# Altium project bee_hive.PrjPcb
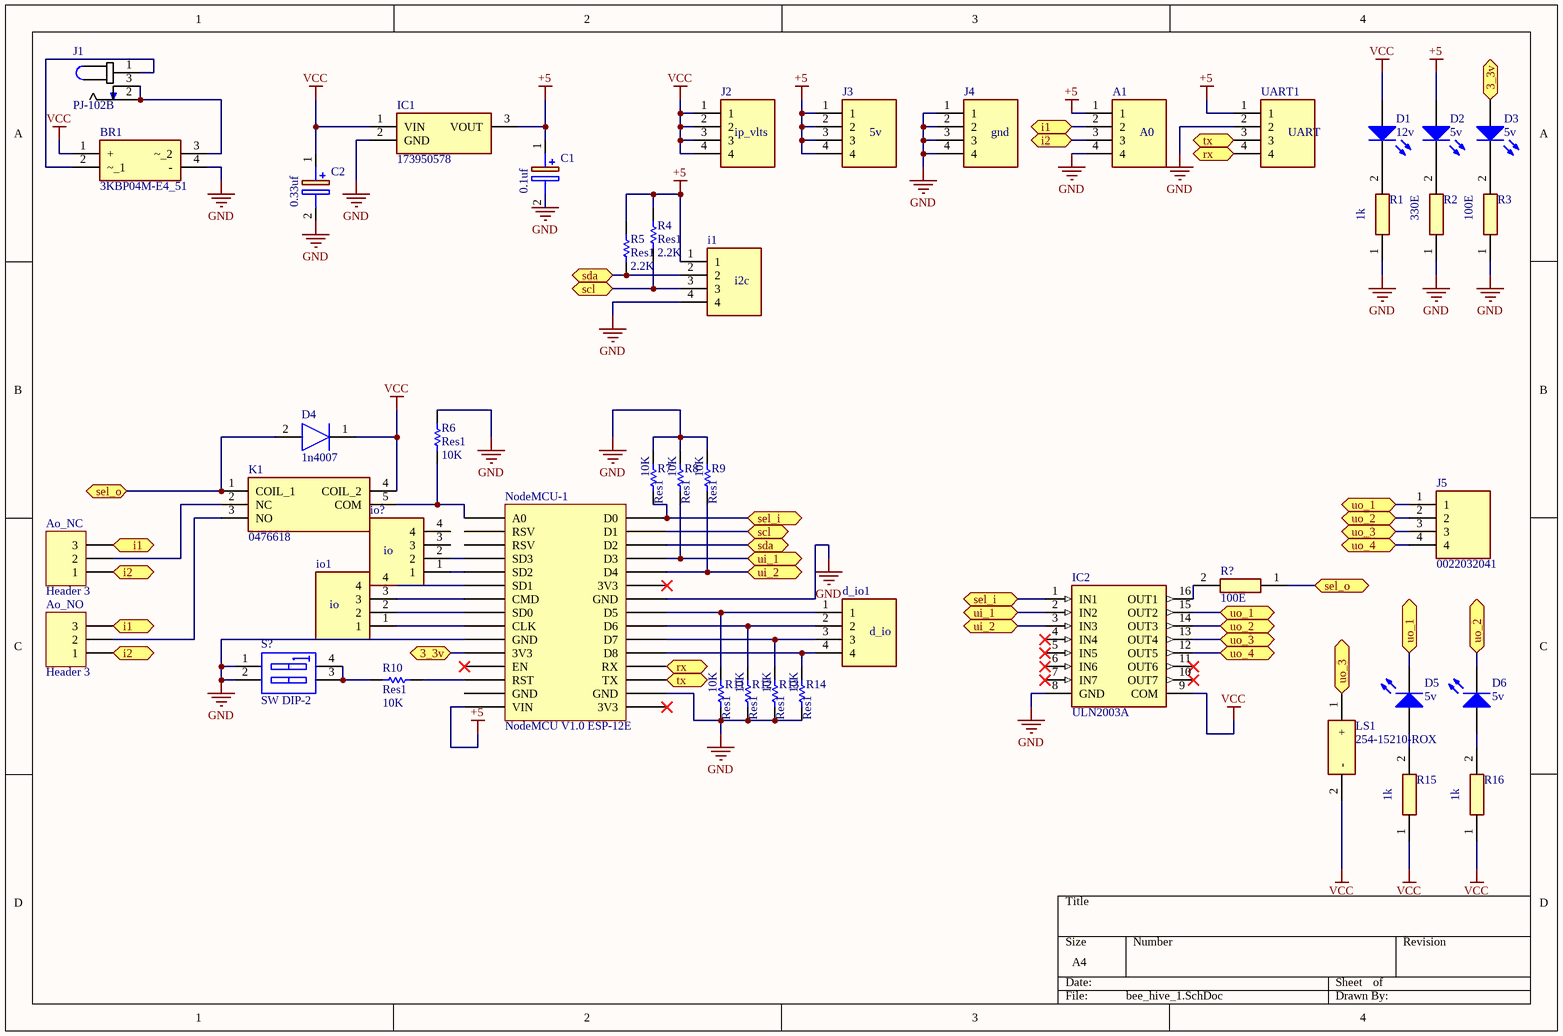
[diagram p0: bee_hive_1.SchDoc]
1 sheet, 45 parts. Net scope: flat (ports and power ports of the same name join across sheets).
Board file: node_mcu.PcbDoc

## Sheet bee_hive_1.SchDoc
size A4

### Parts
A1  A0  [HDRV4W87P0X254_1X4_991X236X1155P]
Ao_NC  Header 3  [HDR1X3]
Ao_NO  Header 3  [HDR1X3]
BR1  3KBP04M-E4_51  [TO385P508X1473X1168-4P]
C1  0.1uf  [CAPPRD250W50D680H1250]
C2  0.33uf  [CAPPRD250W50D680H1250]
D1  12v  [LED-0]
D2  5v  [LED-0]
D3  5v  [LED-0]
D4  1n4007  [DIOAD2902W106L900D500]
D5  5v  [LED-0]
D6  5v  [LED-0]
d_io1  d_io  [HDRV4W87P0X254_1X4_991X236X1155P]
i1  i2c  [HDRV4W87P0X254_1X4_991X236X1155P]
IC1  173950578  [173950578]
IC2  ULN2003A  [DIP794W56P254L1918H533Q16N]
io1  io  [HDRV4W87P0X254_1X4_991X236X1155P]
io?  io  [HDRV4W87P0X254_1X4_991X236X1155P]
J1  PJ-102B  [*CUI_PJ-102B]
J2  ip_vlts  [HDRV4W87P0X254_1X4_991X236X1155P]
J3  5v  [HDRV4W87P0X254_1X4_991X236X1155P]
J4  gnd  [HDRV4W87P0X254_1X4_991X236X1155P]
J5  0022032041  [HDRV4W87P0X254_1X4_991X236X1155P]
K1  0476618  [0476618]
LS1  254-15210-ROX  [25415210ROX]
NodeMCU-1  NodeMCU V1.0 ESP-12E  [NodeMCU V1.0 ESP-12E]
R1  1k  [RESAD1650W60L650D250]
R2  330E  [RESAD1650W60L650D250]
R3  100E  [RESAD1650W60L650D250]
R4  Res1  value 2.2K  [AXIAL-0.3]
R5  Res1  value 2.2K  [AXIAL-0.3]
R6  Res1  value 10K  [AXIAL-0.3]
R7  Res1  value 10K  [AXIAL-0.3]
R8  Res1  value 10K  [AXIAL-0.3]
R9  Res1  value 10K  [AXIAL-0.3]
R10  Res1  value 10K  [AXIAL-0.3]
R11  Res1  value 10K  [AXIAL-0.3]
R12  Res1  value 10K  [AXIAL-0.3]
R13  Res1  value 10K  [AXIAL-0.3]
R14  Res1  value 10K  [AXIAL-0.3]
R15  1k  [RESAD1650W60L650D250]
R16  1k  [RESAD1650W60L650D250]
R?  100E  [RESAD1650W60L650D250]
S?  SW DIP-2  [DIP-4]
UART1  UART  [HDRV4W87P0X254_1X4_991X236X1155P]

### Ports
3_3v (bidir), i1 (bidir), i2 (bidir), rx (bidir), scl (bidir), sda (bidir), sel_i (bidir), sel_o (bidir), tx (bidir), ui_1 (bidir), ui_2 (bidir), uo_1 (bidir), uo_2 (bidir), uo_3 (bidir), uo_4 (bidir)

### Nets
+5: A1.1 C1.1(+) D2.1(A) i1.1 IC1.3(VOUT) J3.1 J3.2 J3.3 J3.4 NodeMCU-1.VIN R4.2 R5.2 UART1.1
GND: A1.4 BR1.4(-) C1.2(-) C2.2(-) i1.4 IC1.2(GND) IC2.8(GND) J4.1 J4.2 J4.3 J4.4 NodeMCU-1.GND R1.1 R2.1 R3.1 R6.2 R7.1 R8.1 R9.1 R11.2 R12.2 R13.2 R14.2 S?.1(A1) S?.2(A2) UART1.2
VCC: BR1.1(+) C2.1(+) D1.1(A) D4.1(K) IC1.1(VIN) IC2.9(COM) J2.1 J2.2 J2.3 J2.4 K1.4(COIL_2) LS1.2(-) R15.1 R16.1
NetA1_2: A1.2 Ao_NC.3 Ao_NO.3 ; port i1
NetA1_3: A1.3 Ao_NC.1 Ao_NO.1 ; port i2
NetAo_NC_2: Ao_NC.2 K1.2(NC)
NetAo_NO_2: Ao_NO.2 K1.3(NO)
NetBR1_2: BR1.2(~_1) J1.1
NetBR1_3: BR1.3(~_2) J1.2 J1.3
NetD1_2: D1.2(K) R1.2
NetD2_2: D2.2(K) R2.2
NetD3_1: D3.1(A) NodeMCU-1.3V3 ; port 3_3v
NetD3_2: D3.2(K) R3.2
NetD4_2: D4.2(A) K1.1(COIL_1) R?.1 ; port sel_o
NetD5_1: D5.1(A) R15.2
NetD5_2: D5.2(K) IC2.15(OUT2) J5.1 ; port uo_1
NetD6_1: D6.1(A) R16.2
NetD6_2: D6.2(K) IC2.14(OUT3) J5.2 ; port uo_2
Netd_io1_1: d_io1.1 NodeMCU-1.D5 R11.1
Netd_io1_2: d_io1.2 NodeMCU-1.D6 R12.1
Netd_io1_3: d_io1.3 NodeMCU-1.D7 R13.1
Netd_io1_4: d_io1.4 NodeMCU-1.D8 R14.1
Neti1_2: i1.2 NodeMCU-1.D2 R5.1 ; port sda
Neti1_3: i1.3 NodeMCU-1.D1 R4.1 ; port scl
NetIC2_1: IC2.1(IN1) NodeMCU-1.D0 R7.2 ; port sel_i
NetIC2_2: IC2.2(IN2) NodeMCU-1.D3 R8.2 ; port ui_1
NetIC2_3: IC2.3(IN3) NodeMCU-1.D4 R9.2 ; port ui_2
NetIC2_12: IC2.12(OUT5) J5.4 ; port uo_4
NetIC2_13: IC2.13(OUT4) J5.3 LS1.1(+) ; port uo_3
NetIC2_16: IC2.16(OUT1) R?.2
Netio1_1: io1.1 NodeMCU-1.CLK
Netio1_2: io1.2 NodeMCU-1.SD0
Netio1_3: io1.3 NodeMCU-1.CMD
Netio1_4: io1.4 NodeMCU-1.SD1
Netio?_1: io?.1 NodeMCU-1.SD2
Netio?_2: io?.2 NodeMCU-1.SD3
NetK1_5: K1.5(COM) NodeMCU-1.A0 R6.1
NetNodeMCU-1_RST: NodeMCU-1.RST R10.1
NetNodeMCU-1_RX: NodeMCU-1.RX UART1.4 ; port rx
NetNodeMCU-1_TX: NodeMCU-1.TX UART1.3 ; port tx
NetR10_2: R10.2 S?.3(B2) S?.4(B1)

Not connected (* = marked no-connect by the designer): IC2 4(IN4)* 5(IN5)* 6(IN6)* 7(IN7)* 10(OUT7)* 11(OUT6)*; io? 3 4; NodeMCU-1 EN* RSV

### Library data of the parts
A1 d_io1 i1 io1 io? J2-J5 UART1 = 0022032041: Connector; Manufacturer_Name: Molex; Datasheet Link: http://www.molex.com/pdm_docs/sd/022032041_sd.pdf; Height: 11.55mm; Manufacturer_Part_Number: 0022032041; Mouser Part Number: N/A; Mouser Price/Stock: https://www.mouser.com/Search/Refine.aspx?Keyword=N%2FA
Ao_NC Ao_NO = Header 3: Header, 3-Pin; LatestRevisionDate: 17-Jul-2002; LatestRevisionNote: Re-released for DXP Platform.; Publisher: Altium Limited
BR1 = 3KBP04M-E4_51: Bridge Rectifier; Manufacturer_Name: Vishay; Manufacturer_Part_Number: 3KBP04M-E4/51; Datasheet Link: https://www.vishay.com/docs/88888/3kbp08m.pdf; Height: 5.08mm; Mouser Part Number: 625-3KBP04M-E4; Mouser Price/Stock: https://www.mouser.com/Search/Refine.aspx?Keyword=625-3KBP04M-E4; RS Part Number: 8116150; RS Price/Stock: https://uk.rs-online.com/web/p/products/8116150
C1 C2 = BKME500ELL100MF11D: Capacitor Polarised; Manufacturer_Name: United Chemi-Con; Datasheet Link: http://www.mouser.com/datasheet/2/420/al-kmebp-e-140701-514734.pdf; Height: 12.5mm; Manufacturer_Part_Number: BKME500ELL100MF11D; Mouser Part Number: 661-BKME500ELL100MF1; Mouser Price/Stock: https://www.mouser.com/Search/Refine.aspx?Keyword=661-BKME500ELL100MF1
D1-D3 D5 D6 = LED0: Typical INFRARED GaAs LED; Published: 8-Jun-2000; LatestRevisionDate: 08-Jul-2005; LatestRevisionNote: Mech Layer 1 removed.; PackageReference: LED-0; Publisher: Altium Limited; PackageDescription: LED; 2 Leads
D4 = 1.5KE68CA-T: Diode; Manufacturer_Name: Diodes Inc.; Datasheet Link: https://www.diodes.com/assets/Datasheets/ds21503.pdf; Manufacturer_Part_Number: 1.5KE68CA-T; Mouser Part Number: 621-1.5KE68CA-T; Mouser Price/Stock: https://www.mouser.com/Search/Refine.aspx?Keyword=621-1.5KE68CA-T
IC1 = 173950578: Integrated Circuit; Manufacturer_Name: Wurth Elektronik; Datasheet Link: https://katalog.we-online.com/pm/datasheet/173950578.pdf; Height: 10.5mm; Manufacturer_Part_Number: 173950578; Mouser Part Number: 710-173950578; Mouser Price/Stock: https://www.mouser.com/Search/Refine.aspx?Keyword=710-173950578; RS Part Number: 1447817P; RS Price/Stock: http://uk.rs-online.com/web/p/products/1447817P
IC2 = ULN2003A: Integrated Circuit; Manufacturer_Name: STMicroelectronics; Allied_Number: 70014189; Datasheet Link: http://www.st.com/web/en/resource/technical/document/datasheet/CD00001244.pdf; Height: 5.33mm; Manufacturer_Part_Number: ULN2003A; Mouser Part Number: 511-ULN2003A; Mouser Price/Stock: https://www.mouser.com/Search/Refine.aspx?Keyword=511-ULN2003A; RS Part Number: 6868209; RS Price/Stock: http://uk.rs-online.com/web/p/products/6868209; Allied Price/Stock: http://www.alliedelec.com/stmicroelectronics-uln2003a/70014189/; ComponentLink1Description: datashet; ComponentLink1URL: https://www.seeedstudio.com/document/pdf/ULN2003%20Datasheet.pdf
K1 = 0476618: Relay or Contactor; Manufacturer_Name: RS Components; Datasheet Link: https://docs-emea.rs-online.com/webdocs/1583/0900766b81583163.pdf; Height: 15mm; Manufacturer_Part_Number: 0476618; ComponentLink1Description: datasheet; ComponentLink1URL: https://www.hobbytronics.co.uk/datasheets/songle-12v-relay.pdf
LS1 = 254-15210-ROX: Loudspeaker or Buzzer; Manufacturer_Name: Kobitone; Datasheet Link: https://www.mouser.de/datasheet/2/209/KT-400269-1172018.pdf; Height: 8.51mm; Manufacturer_Part_Number: 254-15210-ROX
NodeMCU-1 = NodeMCU V1.0 ESP-12E: NodeMCU V1.0 ESP8266 (ESP-12E)
R1-R3 R15 R16 R? = MRS25000C1000FCT00: Resistor; Manufacturer_Name: Vishay; Datasheet Link: http://www.vishay.com/docs/28724/mrs16m25.pdf; Manufacturer_Part_Number: MRS25000C1000FCT00; Mouser Part Number: 594-MRS25000C1000FCT; Mouser Price/Stock: https://www.mouser.com/Search/Refine.aspx?Keyword=594-MRS25000C1000FCT
R4-R14 = Res1: Resistor; Published: 8-Jun-2000; LatestRevisionDate: 17-Jul-2002; LatestRevisionNote: Re-released for DXP Platform.; PackageReference: AXIAL-0.3; Publisher: Altium Limited; PackageDescription: Axial Device, Thru-Hole; 2 Leads; 0.3 in Pin Spacing
S? = SW DIP-2: DIP Switch, 2 Position, SPST; Published: 24-Mar-1999; LatestRevisionDate: 17-Jul-2002; LatestRevisionNote: Re-released for DXP Platform.; PackageReference: DIP-4; Publisher: Altium Limited
J1 = PJ-102B: Value: *